# Altium schematic sheet ESP8266_Project_Schematic.SchDoc
size A4
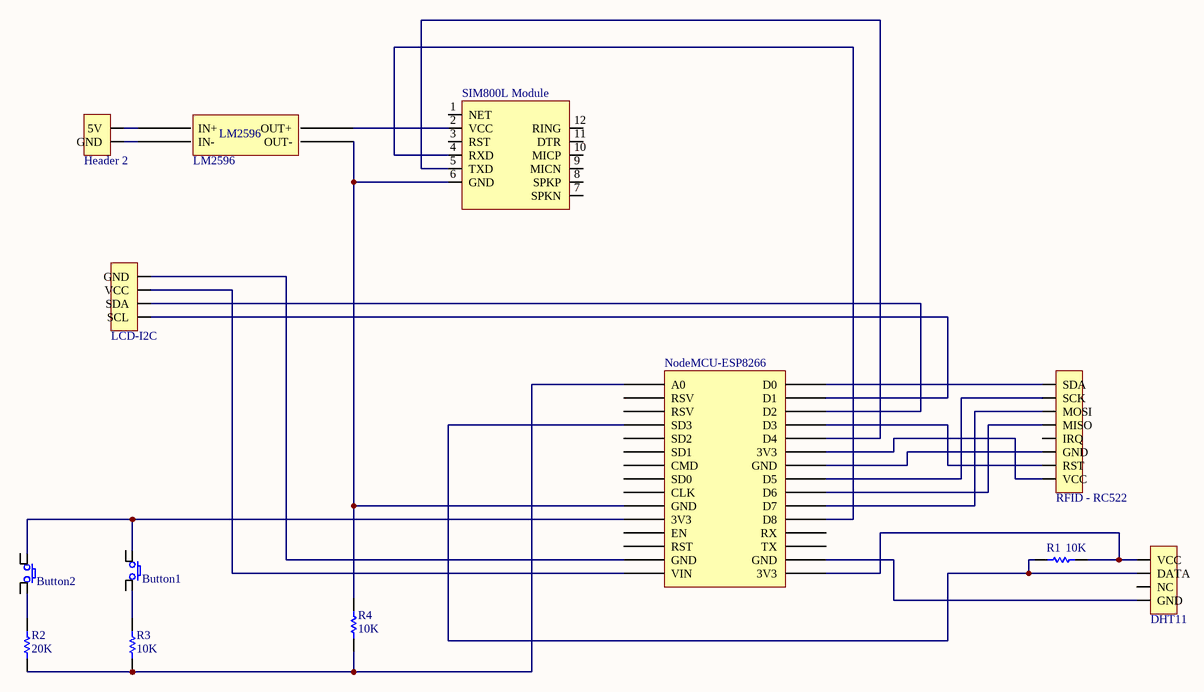
[diagram p0: ESP8266_Project_Schematic.SchDoc]

## Parts
Button1  Tact Switch  [SW/4/DIP/SMALL]  (value not drawn)
Button2  Tact Switch  [SW/4/DIP/SMALL]  (value not drawn)
DHT11  DHT11  [Header 4]  (value not drawn)
Header_2  Header 2  [Header 2]  (value not drawn)
LCD-I2C  LCD-I2C  [Header 4]  (value not drawn)
LM2596  BUCK_LM2596  [BUCK_LM2596]  (value not drawn)
NodeMCU-ESP8266  NodeMCU V1.0 ESP-12E  [NodeMCU V1.0 ESP-12E]  (value not drawn)
R1  10K  [R 1/4W]
R2  20K  [R 1/4W]
R3  10K  [R 1/4W]
R4  10K  [R 1/4W]
RFID_-_RC522  RFID - RC522  [Header 8]  (value not drawn)
SIM800L_Module  SIM800L Module  [SIM800L PINOUT]  (value not drawn)

## Nets
NetButton1_1: Button1.1 Button2.1 NodeMCU-ESP8266.3V3
NetButton1_2: Button1.2 R3.2
NetButton2_2: Button2.2 R2.2
NetDHT11_1: DHT11.1(VCC) NodeMCU-ESP8266.3V3 R1.2
NetDHT11_2: DHT11.2(DATA) NodeMCU-ESP8266.SD3 R1.1
NetDHT11_4: DHT11.4(GND) NodeMCU-ESP8266.GND
NetHeader_2_1: Header_2.1(5V) LM2596.1(IN+)
NetHeader_2_2: Header_2.2(GND) LM2596.2(IN-)
NetLCD-I2C_1: LCD-I2C.1(GND) NodeMCU-ESP8266.GND
NetLCD-I2C_2: LCD-I2C.2(VCC) NodeMCU-ESP8266.VIN
NetLCD-I2C_3: LCD-I2C.3(SDA) NodeMCU-ESP8266.D2
NetLCD-I2C_4: LCD-I2C.4(SCL) NodeMCU-ESP8266.D1
NetLM2596_3: LM2596.3(OUT-) NodeMCU-ESP8266.GND R4.2 SIM800L_Module.6(GND)
NetLM2596_4: LM2596.4(OUT+) SIM800L_Module.2(VCC)
NetNodeMCU-ESP8266_3V3: NodeMCU-ESP8266.3V3 RFID_-_RC522.1(VCC)
NetNodeMCU-ESP8266_A0: NodeMCU-ESP8266.A0 R2.1 R3.1 R4.1
NetNodeMCU-ESP8266_D0: NodeMCU-ESP8266.D0 RFID_-_RC522.8(SDA)
NetNodeMCU-ESP8266_D3: NodeMCU-ESP8266.D3 RFID_-_RC522.2(RST)
NetNodeMCU-ESP8266_D4: NodeMCU-ESP8266.D4 SIM800L_Module.5(TXD)
NetNodeMCU-ESP8266_D5: NodeMCU-ESP8266.D5 RFID_-_RC522.7(SCK)
NetNodeMCU-ESP8266_D6: NodeMCU-ESP8266.D6 RFID_-_RC522.5(MISO)
NetNodeMCU-ESP8266_D7: NodeMCU-ESP8266.D7 RFID_-_RC522.6(MOSI)
NetNodeMCU-ESP8266_D8: NodeMCU-ESP8266.D8 SIM800L_Module.4(RXD)
NetNodeMCU-ESP8266_GND: NodeMCU-ESP8266.GND RFID_-_RC522.3(GND)

Not connected (* = marked no-connect by the designer): Button1 3(1) 4(2); Button2 3(1) 4(2); DHT11 3(NC); NodeMCU-ESP8266 CLK CMD EN RST RSV RX SD0 SD1 SD2 TX; RFID_-_RC522 4(IRQ); SIM800L_Module 1(NET) 3(RST) 7(SPKN) 8(SPKP) 9(MICN) 10(MICP) 11(DTR) 12(RING)

## Library data of the parts
Button1 Button2 = SW SPST-4: Tact switch 4 pin
DHT11 = DHT11: Header, 4-Pin
Header_2 = Header 2: Header, 2-Pin; LatestRevisionDate: 17-Jul-2002; LatestRevisionNote: Re-released for DXP Platform.; Publisher: Altium Limited
LCD-I2C = LCD-I2C: Header, 4-Pin
NodeMCU-ESP8266 = NodeMCU V1.0 ESP-12E: NodeMCU V1.0 ESP8266 (ESP-12E)
R1-R4 = Resistor: Published: 8-Jun-2000; LatestRevisionDate: 17-Jul-2002; LatestRevisionNote: Re-released for DXP Platform.; PackageReference: AXIAL-0.3; Publisher: Altium Limited
RFID_-_RC522 = RFID - RC522: Header, 8-Pin; LatestRevisionDate: 17-Jul-2002; LatestRevisionNote: Re-released for DXP Platform.; Publisher: Altium Limited
SIM800L_Module = SIM800L Module: Header, 5-Pin, Dual row; LatestRevisionDate: 17-Jul-2002; LatestRevisionNote: Re-released for DXP Platform.; Publisher: Altium Limited